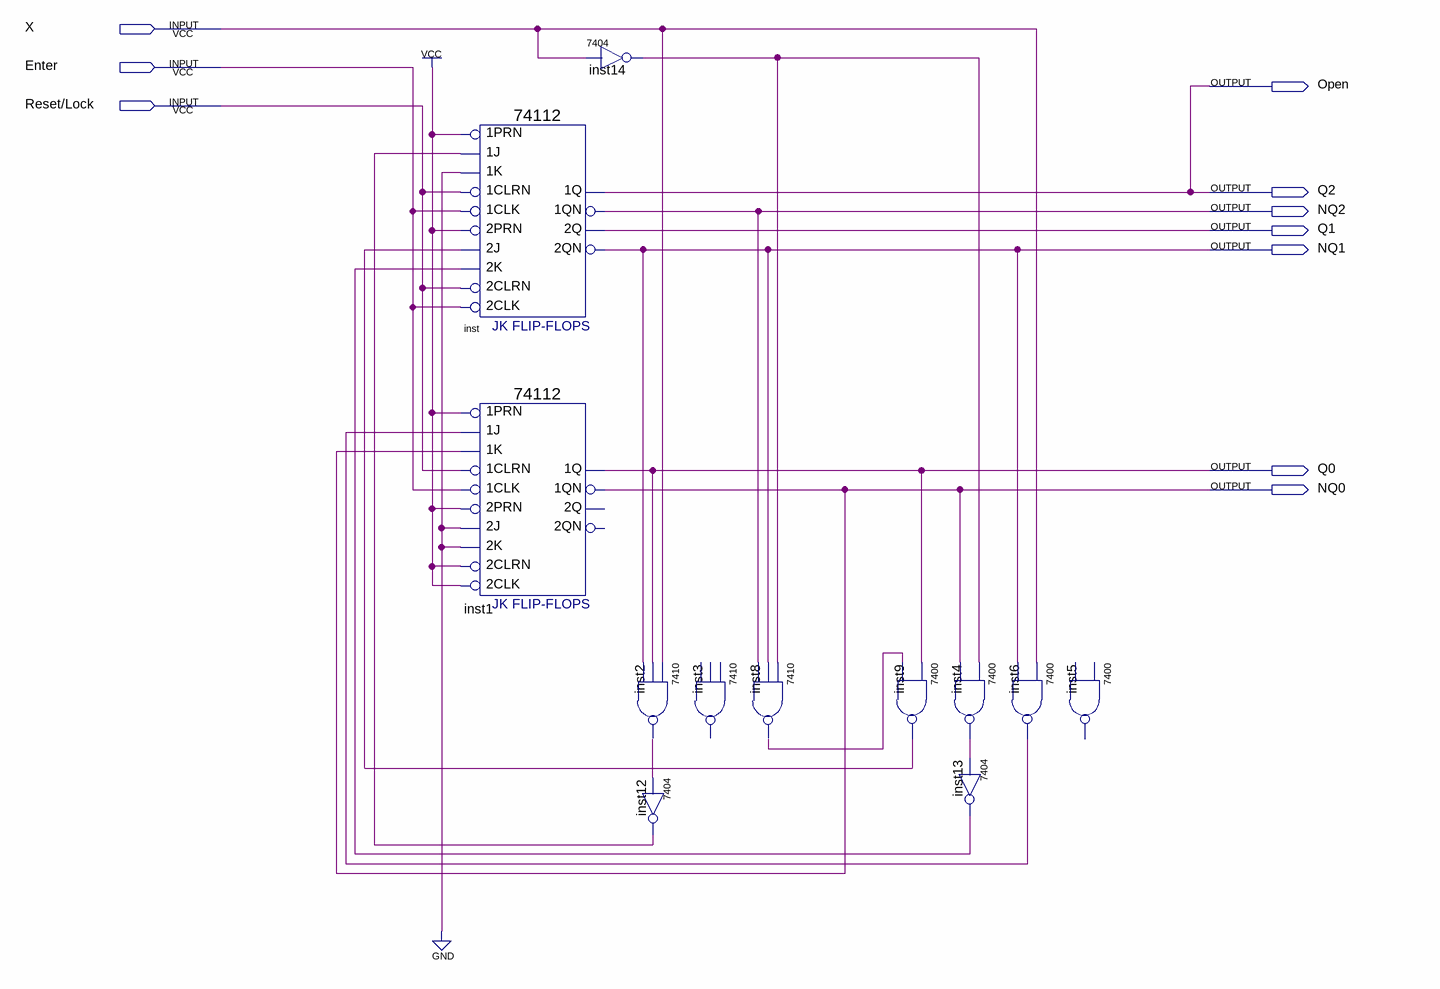
[diagram p0: schematic sheet]
// Quartus schematic lab7.bdf as structural Verilog: 12 symbols, 10 pins
module lab7 (
  input  X,
  input  Enter,
  input  \Reset/Lock ,
  output Open,
  output Q2,
  output NQ2,
  output Q1,
  output NQ1,
  output Q0,
  output NQ0
);

  wire inst2_1, inst4_1, inst6_1, inst8_1, inst9_1, inst12_1, inst13_1, inst14_1;

  \74112  inst (
    .\1K (1'b0), .\1J (inst12_1), .\1PRN (1'b1), .\1CLK (Enter), .\1CLRN (\Reset/Lock ), .\2K (inst13_1),
    .\2J (inst9_1), .\2PRN (1'b1), .\2CLK (Enter), .\2CLRN (\Reset/Lock ), .\1QN (NQ2), .\2Q (Q1),
    .\1Q (Open), .\2QN (NQ1));
  \74112  inst1 (
    .\1K (NQ0), .\1J (inst6_1), .\1PRN (1'b1), .\1CLK (Enter), .\1CLRN (\Reset/Lock ), .\2K (1'b0),
    .\2J (1'b0), .\2PRN (1'b1), .\2CLK (1'b1), .\2CLRN (1'b1), .\1QN (NQ0), .\1Q (Q0));  // open: 2Q, 2QN
  \7404  inst14 (.\2 (X), .\1 (inst14_1));
  \7410  inst2 (.\2 (X), .\3 (Q0), .\4 (NQ1), .\1 (inst2_1));
  \7404  inst12 (.\2 (inst2_1), .\1 (inst12_1));
  \7410  inst3 ();  // open: 2, 3, 4, 1
  \7410  inst8 (.\2 (inst14_1), .\3 (NQ1), .\4 (NQ2), .\1 (inst8_1));
  \7400  inst4 (.\3 (NQ0), .\2 (inst14_1), .\1 (inst4_1));
  \7400  inst9 (.\3 (inst8_1), .\2 (Q0), .\1 (inst9_1));
  \7404  inst13 (.\2 (inst4_1), .\1 (inst13_1));
  \7400  inst6 (.\3 (NQ1), .\2 (X), .\1 (inst6_1));
  \7400  inst5 ();  // open: 3, 2, 1

  assign Q2 = Open;
endmodule
